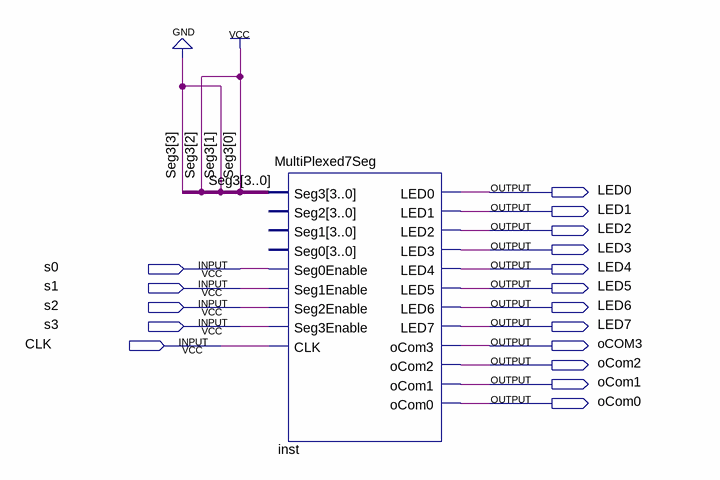
[diagram p0: schematic sheet]
// Quartus schematic Test1.bdf as structural Verilog: 1 symbols, 17 pins
module Test1 (
  input  s0,
  input  s1,
  input  s2,
  input  s3,
  input  CLK,
  output LED0,
  output LED1,
  output LED2,
  output LED3,
  output LED4,
  output LED5,
  output LED6,
  output LED7,
  output oCOM3,
  output oCom2,
  output oCom1,
  output oCom0
);

  MultiPlexed7Seg inst (
    .Seg3(4'b0101), .Seg0Enable(s0), .Seg1Enable(s1), .Seg2Enable(s2), .Seg3Enable(s3), .CLK(CLK),
    .LED0(LED0), .LED1(LED1), .LED2(LED2), .LED3(LED3), .LED4(LED4), .LED5(LED5), .LED6(LED6), .LED7(LED7),
    .oCom3(oCOM3), .oCom2(oCom2), .oCom1(oCom1), .oCom0(oCom0));  // open: Seg2, Seg1, Seg0
endmodule
